# Altium project T24_Dynamics1.0.PrjPcb
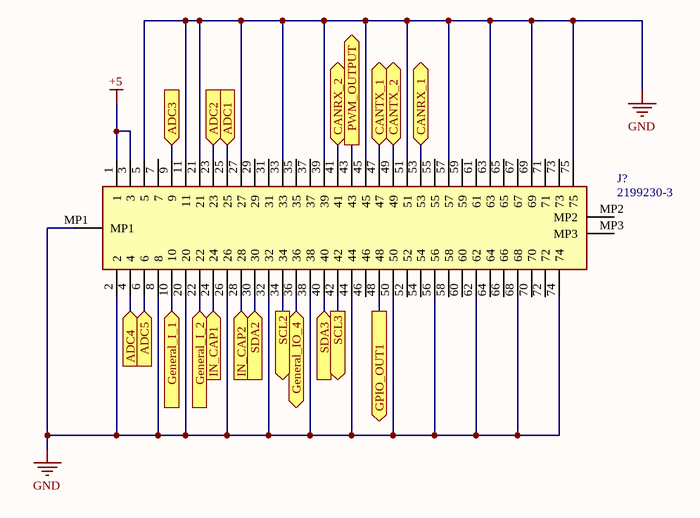
[diagram p0: PIC32MK1024MCM064.SchDoc]
1 sheet, 1 parts. Net scope: flat (ports and power ports of the same name join across sheets).

## Sheet PIC32MK1024MCM064.SchDoc
size A4; SheetNumber: 1; SheetTotal: 1

### Parts
J?  2199230-3  [21992303]

### Ports
ADC1 (in), ADC2 (in), ADC3 (in), ADC4 (in), ADC5 (in), CANRX_1 (bidir), CANRX_2 (bidir), CANTX_1 (bidir), CANTX_2 (bidir), General_I_1 (in), General_I_2 (in), General_IO_4 (bidir), GPIO_OUT1 (out), IN_CAP1 (in), IN_CAP2 (in), PWM_OUTPUT (out), SCL2 (out), SCL3 (out), SDA2 (in), SDA3 (in)

### Nets
+5: J?.1 J?.3
GND: J?.2 J?.5 J?.8 J?.11 J?.20 J?.21 J?.26 J?.27 J?.32 J?.33 J?.38 J?.39 J?.44 J?.45 J?.50 J?.51 J?.56 J?.57 J?.62 J?.63 J?.68 J?.69 J?.74 J?.75 J?.MP1
NetJ?_4: J?.4 ; port ADC4
NetJ?_6: J?.6 ; port ADC5
NetJ?_9: J?.9 ; port ADC3
NetJ?_10: J?.10 ; port General_I_1
NetJ?_22: J?.22 ; port General_I_2
NetJ?_23: J?.23 ; port ADC2
NetJ?_24: J?.24 ; port IN_CAP1
NetJ?_25: J?.25 ; port ADC1
NetJ?_28: J?.28 ; port IN_CAP2
NetJ?_30: J?.30 ; port SDA2
NetJ?_34: J?.34 ; port SCL2
NetJ?_36: J?.36 ; port General_IO_4
NetJ?_40: J?.40 ; port SDA3
NetJ?_41: J?.41 ; port CANRX_2
NetJ?_42: J?.42 ; port SCL3
NetJ?_43: J?.43 ; port PWM_OUTPUT
NetJ?_47: J?.47 ; port CANTX_1
NetJ?_48: J?.48 ; port GPIO_OUT1
NetJ?_49: J?.49 ; port CANTX_2
NetJ?_53: J?.53 ; port CANRX_1

Not connected (* = marked no-connect by the designer): J? 7 29 31 35 37 46 52 54 55 58 59 60 61 64 65 66 67 70 71 72 73 MP2 MP3

### Library data of the parts
J? = 2199230-3: Connector; Manufacturer_Name: TE Connectivity; Datasheet Link: https://componentsearchengine.com/Datasheets/2/2199230-3.pdf; Height: 4.2mm; Manufacturer_Part_Number: 2199230-3; Mouser Part Number: 571-2199230-3; Mouser Price/Stock: https://www.mouser.co.uk/ProductDetail/TE-Connectivity/2199230-3?qs=EQCnRgr4b6HElQOKr5ma1Q%3D%3D; Arrow Part Number: 2199230-3; Arrow Price/Stock: https://www.arrow.com/en/products/2199230-3/te-connectivity?region=nac